# EAGLE design Vorladeschaltung (EAGLE 6.6.0)
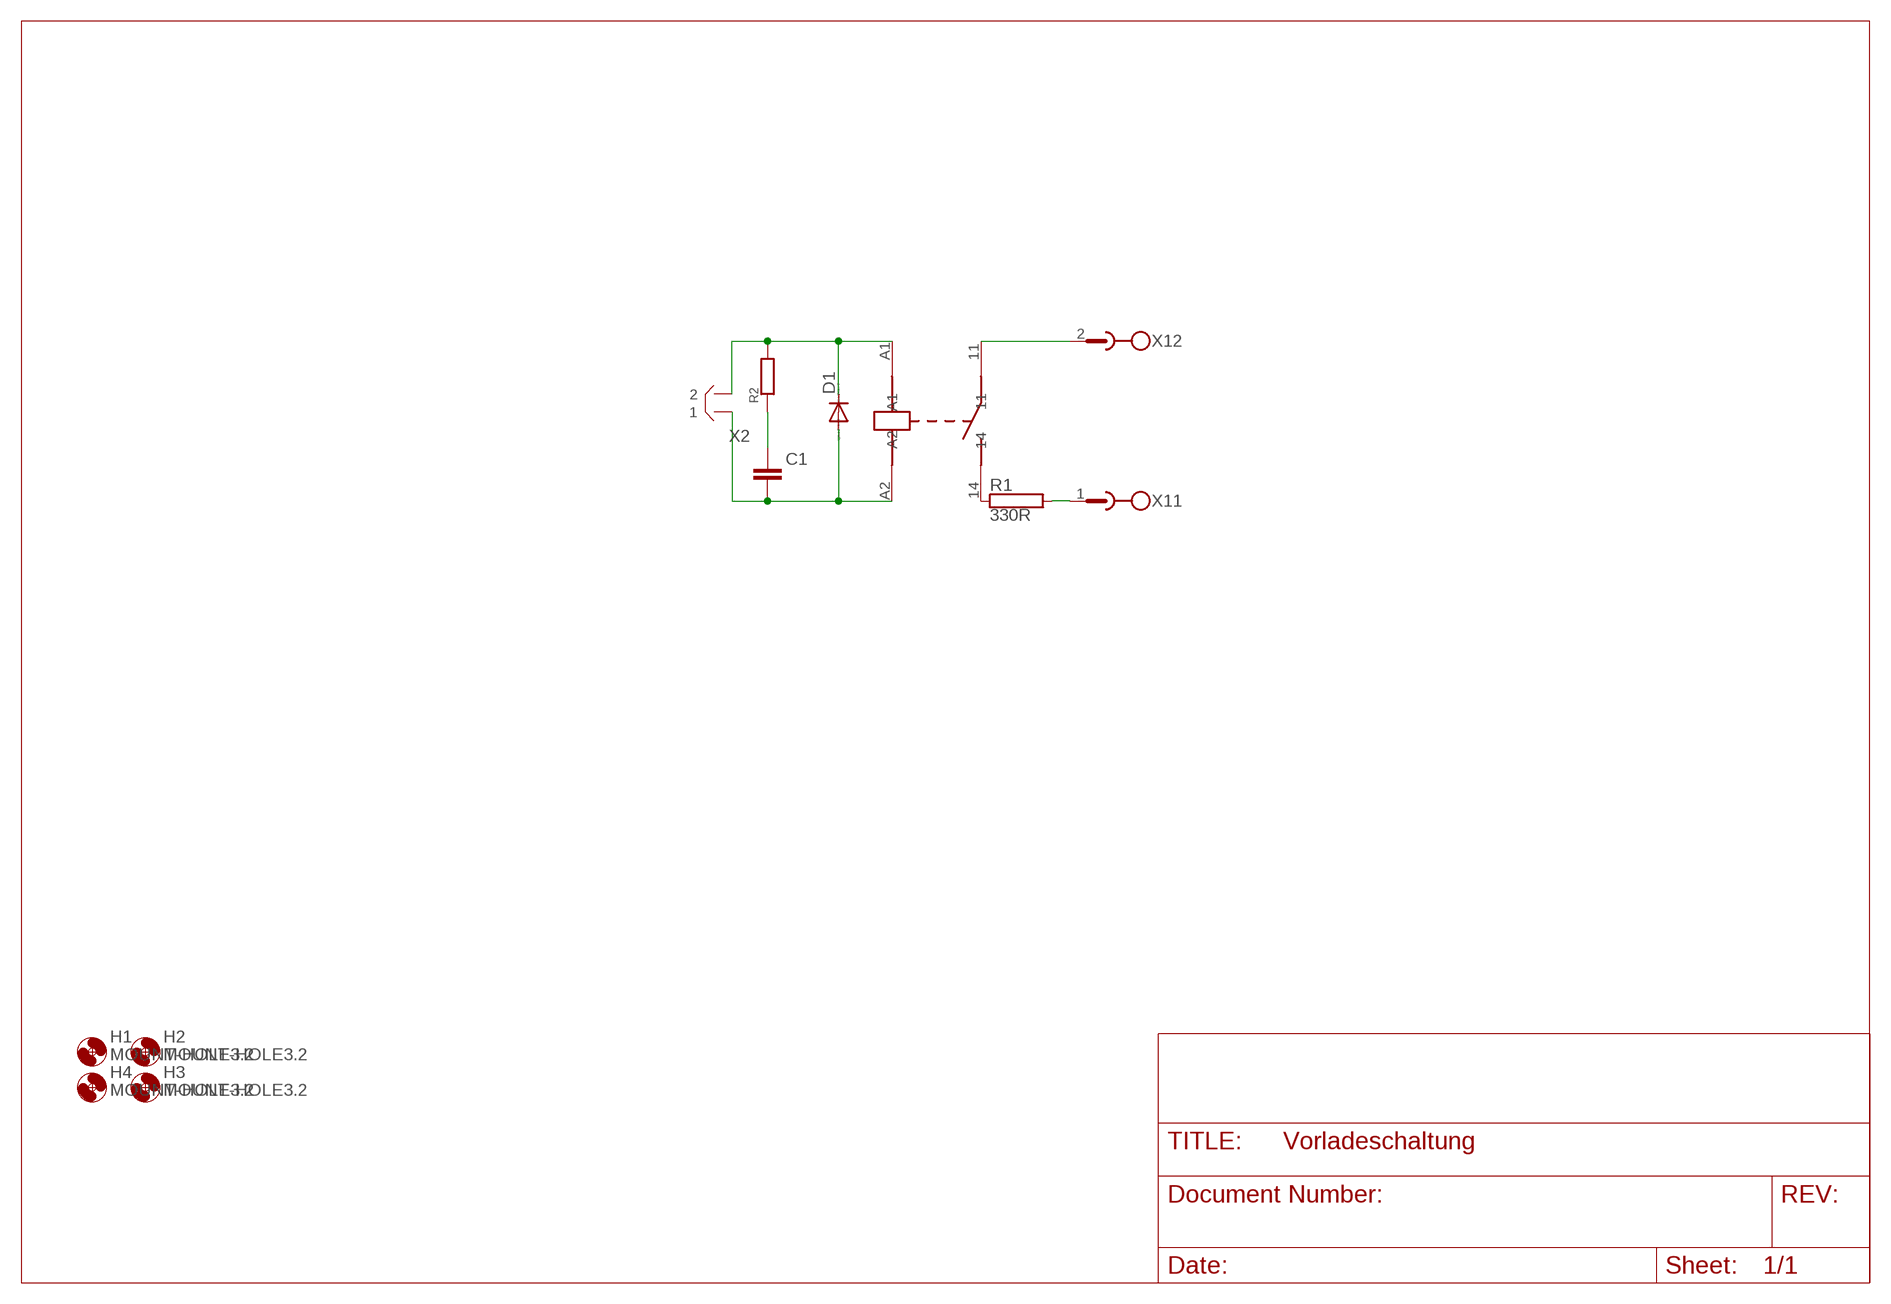
[diagram p0: schematic, sheet 1]

## Parts
C1  CSTD  [C0805]
D1  DIODE-SOD323-W  [SOD323-W]
H1  MOUNT-HOLE3.2  [3,2]
H2  MOUNT-HOLE3.2  [3,2]
H3  MOUNT-HOLE3.2  [3,2]
H4  MOUNT-HOLE3.2  [3,2]
K1  OJ-SH-112DMBIG  [RELAIS-TE-OJ-BIG]
R1  330R  RWH25  [WH25]
R2  R  [R0805]
X1  MSTBX2MSTBA2  [MSTBA2]
X2  B-BIG2B-XH  [B2B-XH-BIG]

## Nets
N$1: K1.14 R1.1
N$2: D1.C K1.A1 R2.2 X2.P$2
N$3: C1.1 D1.A K1.A2 X2.P$1
N$4: K1.11 X1.2
N$5: R1.2 X1.1
N$6: C1.2 R2.1

## Library data of the parts
C1 = useful:C
D1 = diode:DIODE-: DIODE
H1-H4 = holes:MOUNT-HOLE: MOUNTING HOLE with drill center marker
K1 = special:OJ-SH-112DM
R1 = special:R
R2 = useful:R
X1 = con-phoenix:MSTBX2
X2 = con-jst-xh:?2B-XH

## Board
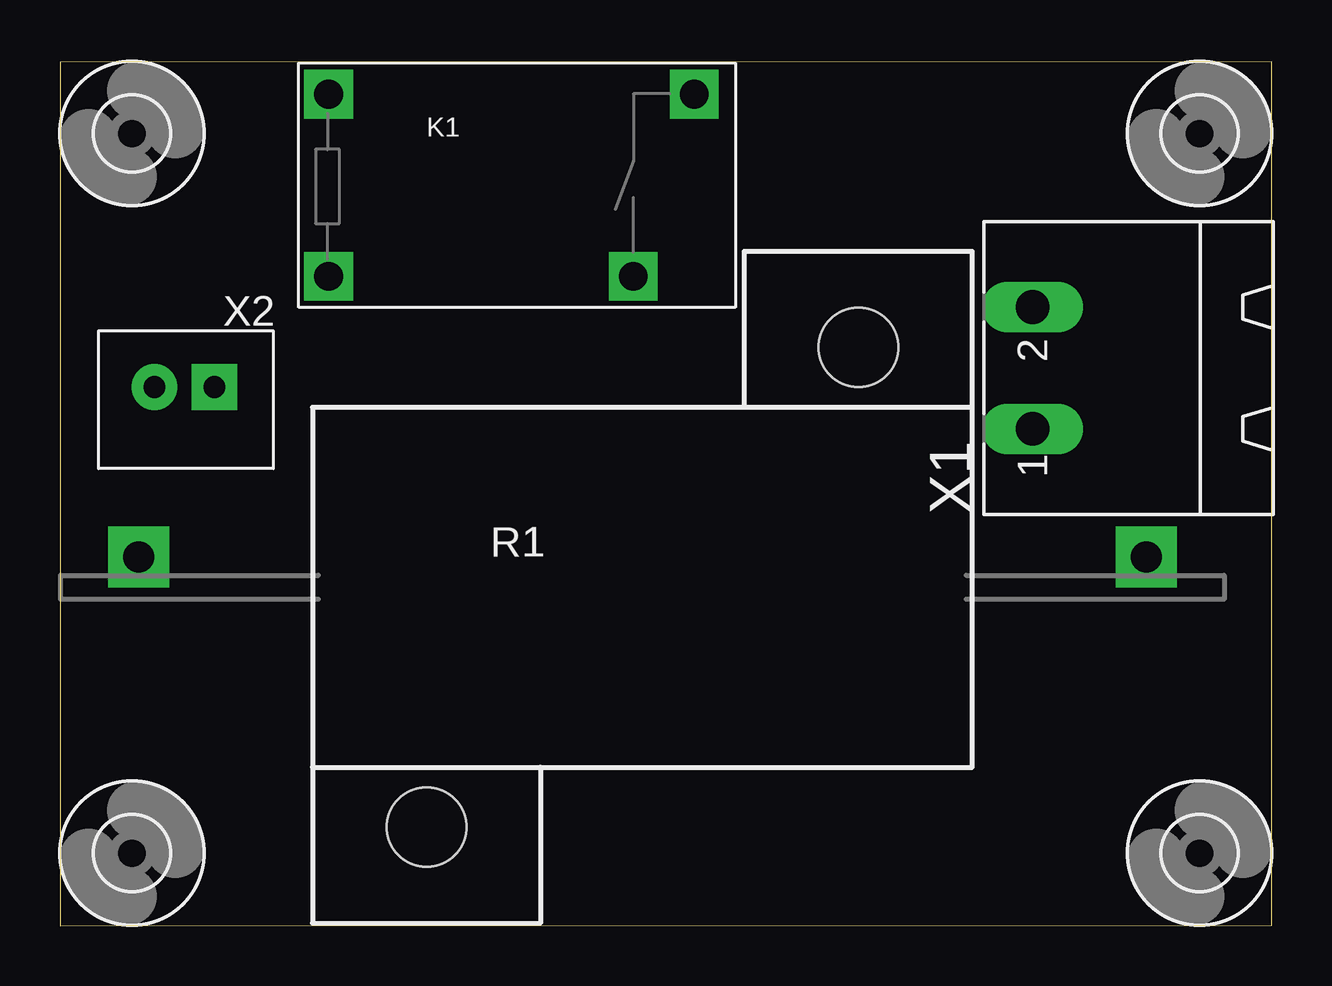
[diagram p1: board, top side]
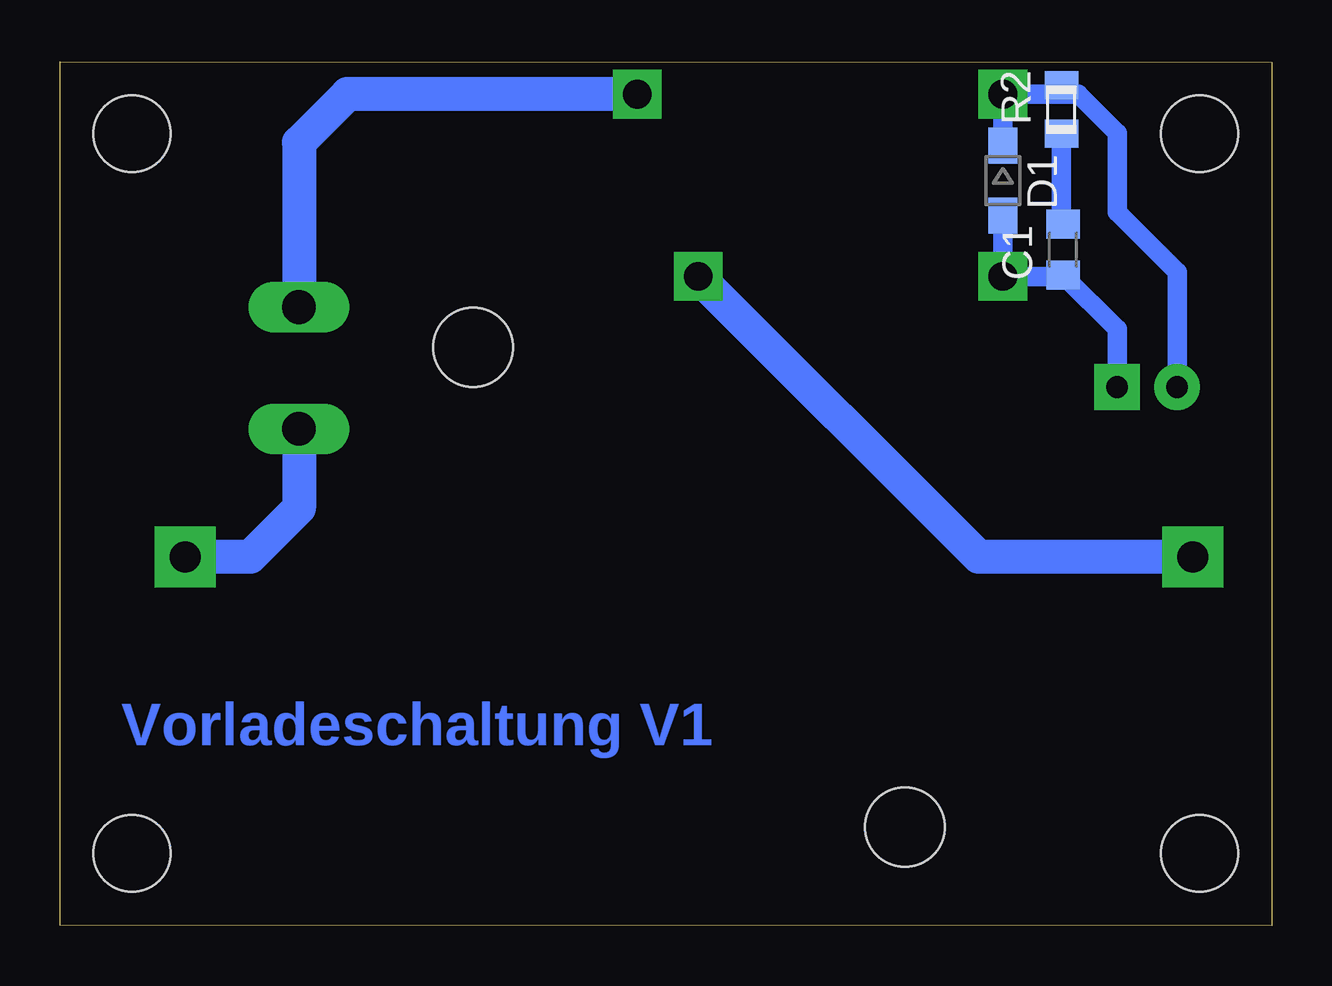
[diagram p2: board, bottom side, seen from below]

Size 50.5 x 36.02 mm. Coordinates in mm from the lower left corner, seen from the top.
Outline: 0,0 50.5,0.02 50.5,36.02 0,36 0,0
Copper layers (1+2*15+16): Top 0.035mm / dielectric 0.2mm / Route2 0.035mm / dielectric 0.5mm / Route15 0.035mm / dielectric 0.2mm / Bottom 0.035mm
Design rules "ats_35u_4layer": minimum track width 6mil, minimum drill 0.2mm, track to track 6mil, track to pad 6mil, pad to pad 6mil, via to via 6mil, smd to smd 6mil, copper to edge 0.3mm, drill to drill 8mil, minimum pad ring 10mil, minimum via ring 0.2mm, stop-mask expansion 4mil, vias tented up to drill 0mil, thermal gap 10mil

### Footprints (pad centres in the part's own frame; a part is rotated, then mirrored left to right if it is on the bottom)
C0805 = smd 1.2 x 1.4: 1 -1.066,0; 2 1.066,0
SOD323-W = smd 1.5 x 1.2: A 1.45,0; C -1.45,0
3,2 = hole 3.2: 0,0
RELAIS-TE-OJ-BIG = drill 1.2 pad 2.032 square: 11 8.89,3.8; 14 6.35,-3.8; A1 -6.35,3.8; A2 -6.35,-3.8
WH25 = drill 1.3 pad 2.54 square: 1 -21,1.27; 2 21,1.27 | hole 3.3: -9,-10; 9,10
R0805 = smd 1.168 x 1.397: 1 -1.016,0; 2 1.016,0
MSTBA2 = drill 1.397 long: 1 0,0; 2 5.08,0
B2B-XH-BIG = drill 0.9 pad 1.905 square: P$1 0,0 | drill 0.9 pad 1.905: P$2 2.5,0

### Placement (x,y rotation side)
C1  8.69,28.18 90 bottom
D1  11.2,31.05 270 bottom
H1  3,3.02 0 top
H2  47.5,3.02 0 top
H3  47.5,33.02 0 top
H4  3,33.02 0 top
K1  17.55,30.86 0 top
R1  24.28,14.1 0 top
R2  8.76,34.02 90 bottom
X1  40.54,20.7 90 top
X2  6.44,22.45 180 top

### Tracks (layer width: path | path; a pad name or v marks a point on that pad's centre or on a via)
N$1
  Bottom 1.422: R1.1 12.21,15.37 K1.14
N$2
  Bottom 0.61: 8.76,34.66 R2.2
  Bottom 0.813: D1.C K1.A1 8.76,34.66 8.05,34.66 6.42,33.03 6.42,29.73 3.94,27.25 X2.P$2
N$3
  Bottom 0.406: 8.52,27.06 8.69,27.06 C1.1
  Bottom 0.813: 8.69,27.06 K1.A2 D1.A | X2.P$1 6.44,24.86 C1.1
N$4
  Bottom 1.422: K1.11 38.52,34.66 40.54,32.64 X1.2
N$5
  Bottom 1.422: X1.1 40.54,17.4 42.57,15.37 R1.2
N$6
  Bottom 0.406: C1.2 8.76,29.25
  Bottom 0.813: 8.76,29.25 R2.1

### Text on the board
Bottom: Vorladeschaltung V1